# Altium schematic sheet GateDriver.SchDoc
size B; SheetNumber: 7; SheetTotal: 15
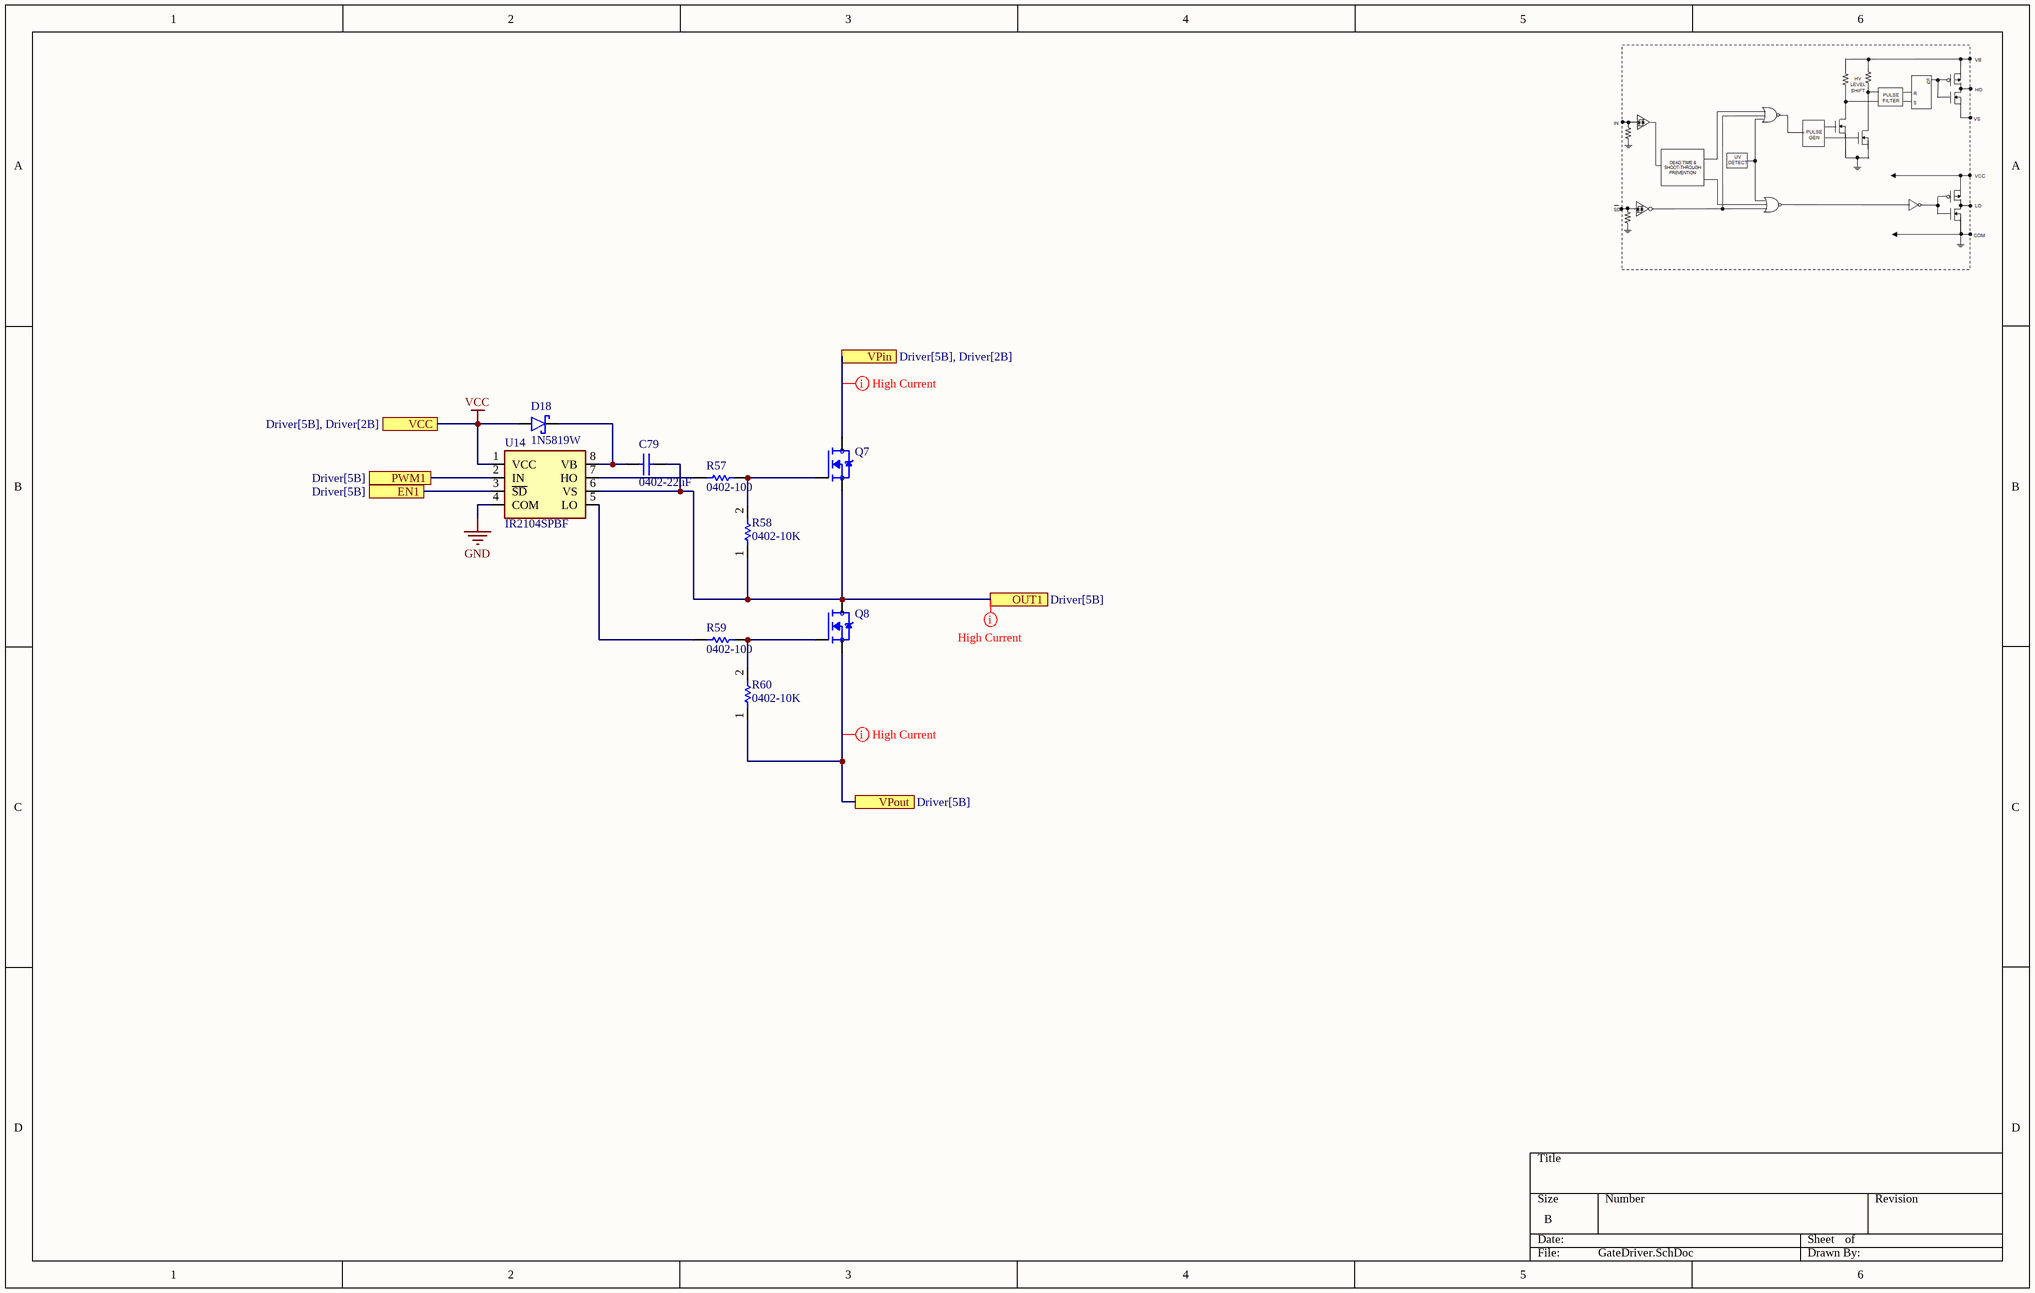
[diagram p0: GateDriver.SchDoc]

## Parts
C79  0402-22uF  [CAPC0402(1005)60_N]
D18  1N5819W  [1N5819W]
Q7  IRLR7843TRPBF  [TO229P990X239-3_4N]  (value not drawn)
Q8  IRLR7843TRPBF  [TO229P990X239-3_4N]  (value not drawn)
R57  0402-100  [R-0402-1K]
R58  0402-10K  [R-0402-10K]
R59  0402-100  [R-0402-1K]
R60  0402-10K  [R-0402-10K]
U14  IR2104SPBF  [IR2104SPBF]

## Ports
EN1 (see Driver[5B]), OUT1 (see Driver[5B]), PWM1 (see Driver[5B]), VCC (see Driver[5B], Driver[2B]), VPin (see Driver[5B], Driver[2B]), VPout (see Driver[5B])

## Nets
GND: U14.4(COM)
VCC: D18.A U14.1(VCC) ; port VCC
EN1: U14.3(~{SD}) ; port EN1
OUT1: C79.2 Q7.3(S) Q8.4(D) R58.1 U14.6(VS) ; port OUT1
PWM1: U14.2(IN) ; port PWM1
VPin: Q7.4(D) ; port VPin
VPout: Q8.3(S) R60.1 ; port VPout
NetC79_1: C79.1 D18.K U14.8(VB)
NetQ7_1: Q7.1(G) R57.2 R58.2
NetQ8_1: Q8.1(G) R59.2 R60.2
NetR57_1: R57.1 U14.7(HO)
NetR59_1: R59.1 U14.5(LO)

## Layout directives
rule Width Constraint [Pref Width = 30mil    Min Width = 30mil    Max Width = 100mil]; net class Motor Power: OUT1, VPin, VPout

## Library data of the parts
C79 = CMP-001-00366-1: Capacitor 22uF 0402; Value: 22µF; Voltage Rating (DC): 4V; Tolerance: 20%; Dielectric: X5R; Construction: Flat; Max Operating Temperature: 85°C; Design Item ID: CMP-1034-02139-2; Case Code (Metric): 1005; Mount: Surface Mount; RoHS Compliant: Yes; Package Quantity: 1; Voltage Rating: 4V; Width: 0.02inch; Length: 0.039inch; Source: 0402-10uF.SchLib; Pins: 2; Packaging: Tape and Reel; Case/Package: 0402; Height: 0.5mm; Halogen Free: Halogen Free; Min Operating Temperature: -55°C; Thickness: 0.028inch; Series: M; Termination: SMD/SMT; Component Type: Standard
D18 = CMP-004-00113-1: Source: 1N5819W.SchLib; Design Item ID: 1N5819W; Pins: 2; Component Type: Standard
Q7 Q8 = CMP-123-000003-1: RoHS Compliant; MF: Infineon Technologies; Design Item ID: IRLR7843TRPBF; SnapEDA_Link: https://www.snapeda.com/parts/IRLR7843TRPBF/Infineon+Technologies/view-part/?ref=snap; Price: None; Package: TO-252-3 Infineon; Availability: In Stock; Purchase-URL: https://pricing.snapeda.com/search/part/IRLR7843TRPBF/?ref=eda; Check_prices: https://www.snapeda.com/parts/IRLR7843TRPBF/Infineon+Technologies/view-part/?ref=eda; Component Type: Standard; Source: IRLR7843TRPBF.SchLib; Pin Count: 3; MP: IRLR7843TRPBF; Value: *
R57 R59 = CMP-009-00677-3: 0402Resistor 100Ohm; Value: 100
R58 R60 = CMP-009-00675-4: RES 0402 10K; Value: 10k
U14 = CMP-031-00014-2: Half-Bridge Gate Driver IC Non-Inverting 8-SOIC; MF: Infineon; Pins: 8; Check_prices: https://www.snapeda.com/parts/IR2104SPBF/Infineon/view-part/?ref=eda; SnapEDA_Link: https://www.snapeda.com/parts/IR2104SPBF/Infineon/view-part/?ref=snap; Design Item ID: IR2104SPBF; Source: IR2104SPBF.SchLib; Component Type: Standard; Value: *; Case/Package: SOIC-8 Infineon; MP: IR2104SPBF